# Altium schematic sheet ESP.SchDoc
size A4; SheetNumber: 1; SheetTotal: 1
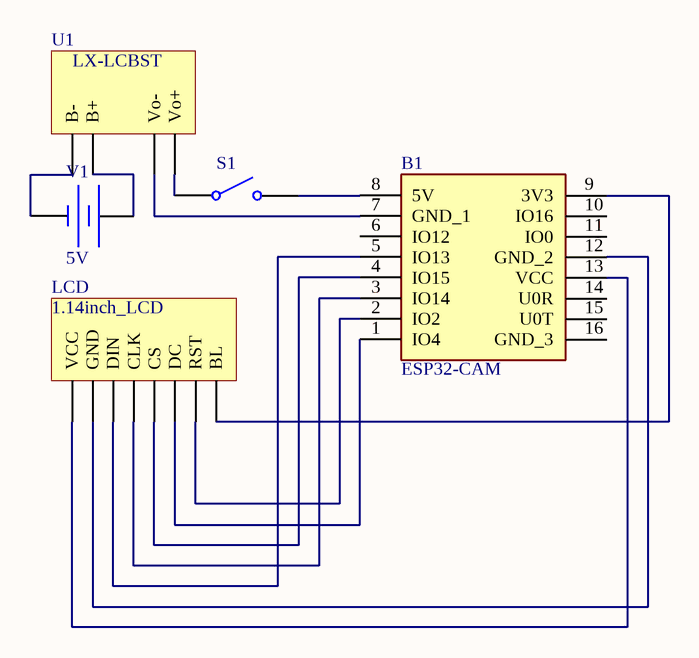
[diagram p0: ESP.SchDoc]

## Parts
B1  ESP32-CAM  [ESP32CAM]
LCD  1.14inch_LCD  [LCD]
S1  Single-Pole, Single-Throw Switch  (value not drawn)
U1  LX-LCBST
V1  DC Magnitude: 5V  (hidden comment: Constant Voltage Source)

## Nets
NetB1_1: B1.1(IO4) LCD.?6(DC)
NetB1_2: B1.2(IO2) LCD.?7(RST)
NetB1_3: B1.3(IO14) LCD.?4(CLK)
NetB1_4: B1.4(IO15) LCD.?5(CS)
NetB1_5: B1.5(IO13) LCD.?3(DIN)
NetB1_7: B1.7(GND_1) U1.?3(Vo-)
NetB1_8: B1.8(5V) S1.2
NetB1_9: B1.9(3V3) LCD.?8(BL)
NetB1_12: B1.12(GND_2) LCD.?2(GND)
NetB1_13: B1.13(VCC) LCD.?1(VCC)
NetS1_1: S1.1 U1.?4(Vo+)
NetU1_?1: U1.?1(B-) V1.2
NetU1_?2: U1.?2(B+) V1.1

Not connected (* = marked no-connect by the designer): B1 6(IO12) 10(IO16) 11(IO0) 14(U0R) 15(U0T) 16(GND_3)

## Library data of the parts
B1 = ESP32-CAM: Modules PCBA Module RoHS; Manufacturer_Name: Ai-Thinker; Geometry.Height: 5mm; Manufacturer_Part_Number: ESP32-CAM; Mouser Part Number: *; Mouser Price/Stock: *; Arrow Part Number: *; Arrow Price/Stock: *; Datasheet Link: https://datasheet.lcsc.com/szlcsc/Ai-Thinker-ESP32-CAM_C277946.pdf
S1 = SPST SW: closed: 0; Rclosed: 1m; Ropen: 1Meg; SimulationGenericComponent: True
V1 = Battery: SimulationGenericComponent: True